# EAGLE design Sonar_Power_Schematic (EAGLE 8.4.0)
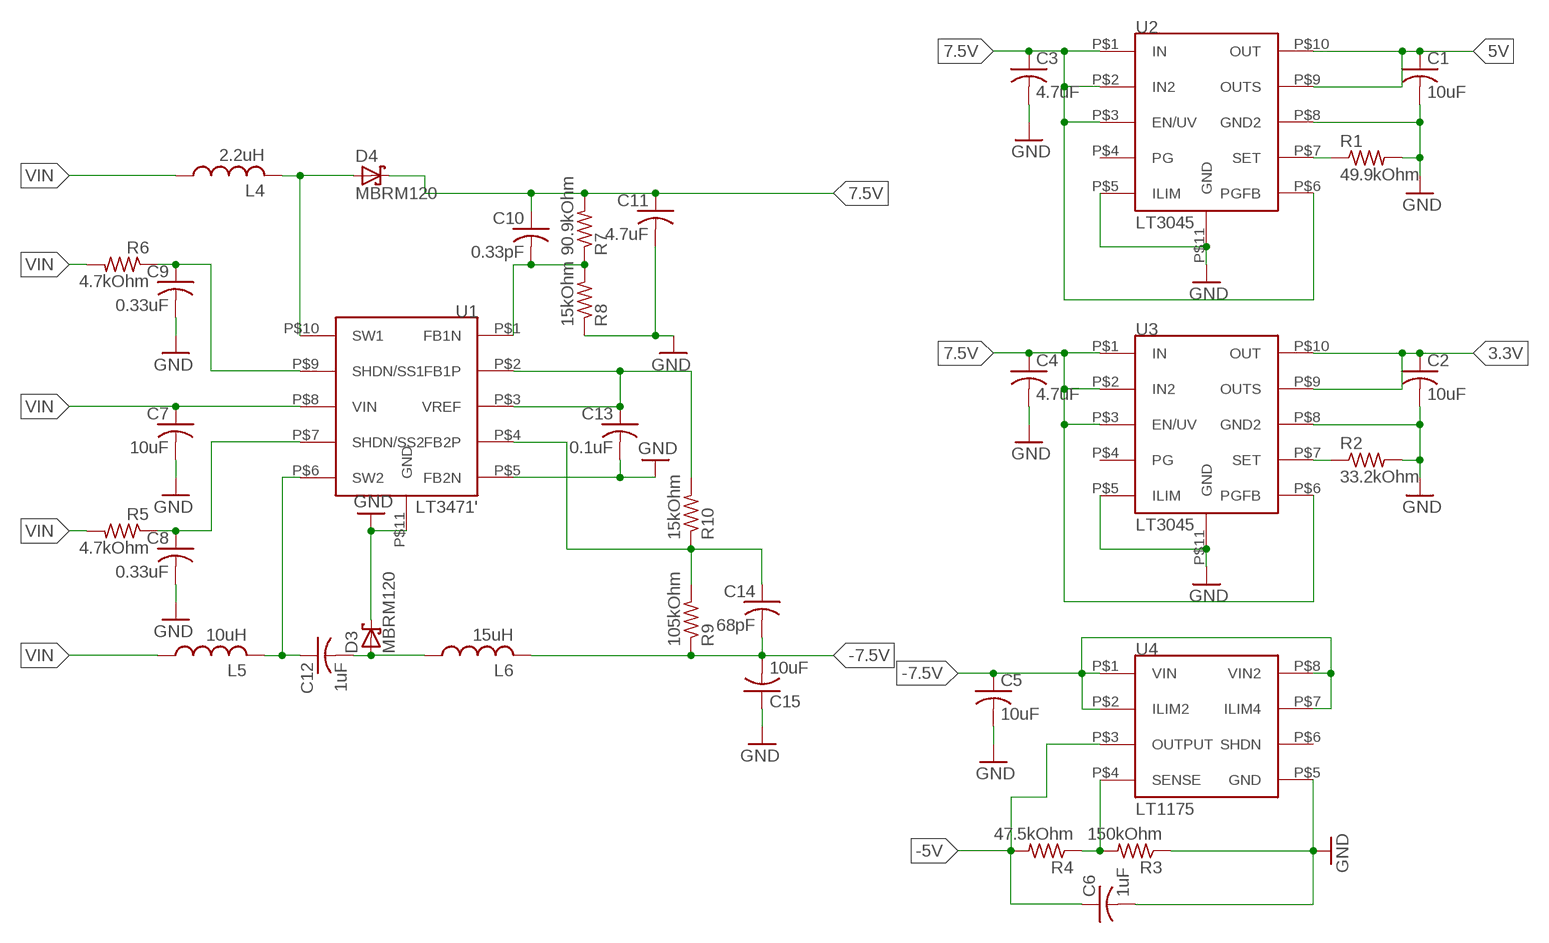
[diagram p0: schematic, sheet 1]

## Parts
C1  10uF  C-USC1206K  [C1206K]
C2  10uF  C-USC1206K  [C1206K]
C3  4.7uF  C-USC0603  [C0603]
C4  4.7uF  C-USC0603  [C0603]
C5  10uF  C-USC0603  [C0603]
C6  1uF  C-USC0603  [C0603]
C7  10uF  C-USC0603  [C0603]
C8  0.33uF  C-USC0603  [C0603]
C9  0.33uF  C-USC0603  [C0603]
C10  0.33pF  C-USC0603  [C0603]
C11  4.7uF  C-USC0603  [C0603]
C12  1uF  C-USC0603  [C0603]
C13  0.1uF  C-USC0603  [C0603]
C14  68pF  C-USC0603  [C0603]
C15  10uF  C-USC0603  [C0603]
D3  MBRM120  [DO-216AA]
D4  MBRM120  [DO-216AA]
L4  2.2uH  LQH5BPN2R2N38L  [NS4.9X4.9]
L5  10uH  VLS5045EX-100M2  [NS5X5]
L6  15uH  VLS5045EX-150M-CA1  [NS5X5]
R1  49.9kOhm  R-US_R0603  [R0603]
R2  33.2kOhm  R-US_R0603  [R0603]
R3  150kOhm  R-US_R0603  [R0603]
R4  47.5kOhm  R-US_R0603  [R0603]
R5  4.7kOhm  R-US_R0603  [R0603]
R6  4.7kOhm  R-US_R0603  [R0603]
R7  90.9kOhm  R-US_R0603  [R0603]
R8  15kOhm  R-US_R0603  [R0603]
R9  105kOhm  R-US_R0603  [R0603]
R10  15kOhm  R-US_R0603  [R0603]
U1  LT3471'  [10-WFDFN]
U2  LT3045  [10-WFDFN]
U3  LT3045  [10-WFDFN]
U4  LT1175  [8-SOIC]

## Nets
3.3V: C2.1 U3.P$9(OUTS) U3.P$10(OUT)
5V: C1.1 U2.P$9(OUTS) U2.P$10(OUT)
7.5V: C3.1 C4.1 C10.1 C11.1 D4.P$1(C) R7.2 U2.P$1(IN) U2.P$2(IN2) U2.P$3(EN/UV) U2.P$6(PGFB) U3.P$1(IN) U3.P$2(IN2) U3.P$3(EN/UV) U3.P$6(PGFB)
-5V: C6.1 R4.2 U4.P$3(OUTPUT)
-7.5V: C5.1 C14.2 C15.2 L6.P$2 R9.1 U4.P$1(VIN) U4.P$2(ILIM2) U4.P$7(ILIM4) U4.P$8(VIN2)
GND: C1.2 C2.2 C3.2 C4.2 C5.2 C6.2 C7.2 C8.2 C9.2 C11.2 C13.2 C15.1 D3.P$1(C) R1.2 R2.2 R3.1 R8.1 U1.P$5(FB2N) U1.P$11(GND) U2.P$5(ILIM) U2.P$8(GND2) U2.P$11(GND) U3.P$5(ILIM) U3.P$8(GND2) U3.P$11(GND) U4.P$5(GND)
N$4: R2.1 U3.P$7(SET)
N$6: R1.1 U2.P$7(SET)
N$9: R3.2 R4.1 U4.P$4(SENSE)
N$17: D4.P$2(A) L4.P$2 U1.P$10(SW1)
N$18: C10.2 R7.1 R8.2 U1.P$1(FB1N)
N$20: C12.1 L5.P$2 U1.P$6(SW2)
N$21: C12.2 D3.P$2(A) L6.P$1
N$26: C14.1 R9.2 R10.1 U1.P$4(FB2P)
SS1: C9.1 R6.1 U1.P$9(SHDN/SS1)
SS2: C8.1 R5.1 U1.P$7(SHDN/SS2)
VIN: C7.1 L4.P$1 L5.P$1 R5.2 R6.2 U1.P$8(VIN)
VREF: C13.1 R10.2 U1.P$2(FB1P) U1.P$3(VREF)
Unconnected: U2.P$4(PG) U3.P$4(PG) U4.P$6(SHDN)

## Library data of the parts
C1-C15 = adafruit:C-US: CAPACITOR, American symbol
D3 D4 = Moira:MBRM120
L4 = Moira:LQH5BPN2R2N38L: 2.2uH
L5 = Moira:VLS5045EX-100M: VLS5045EX-100M, TDK 10uH, 445-174843-1-ND
L6 = Moira:VLS5045EX-150M-CA: VLS5045EX-150M-CA, TDK 15uH, 445-175141-1-ND
R1-R10 = adafruit:R-US_: RESISTOR, American symbol
U1 = Moira:LT3471: LT3471EDD#TRPBF
U2 U3 = Moira:LT3045
U4 = Moira:LT1175: LT1175IS8#PBF

## Board
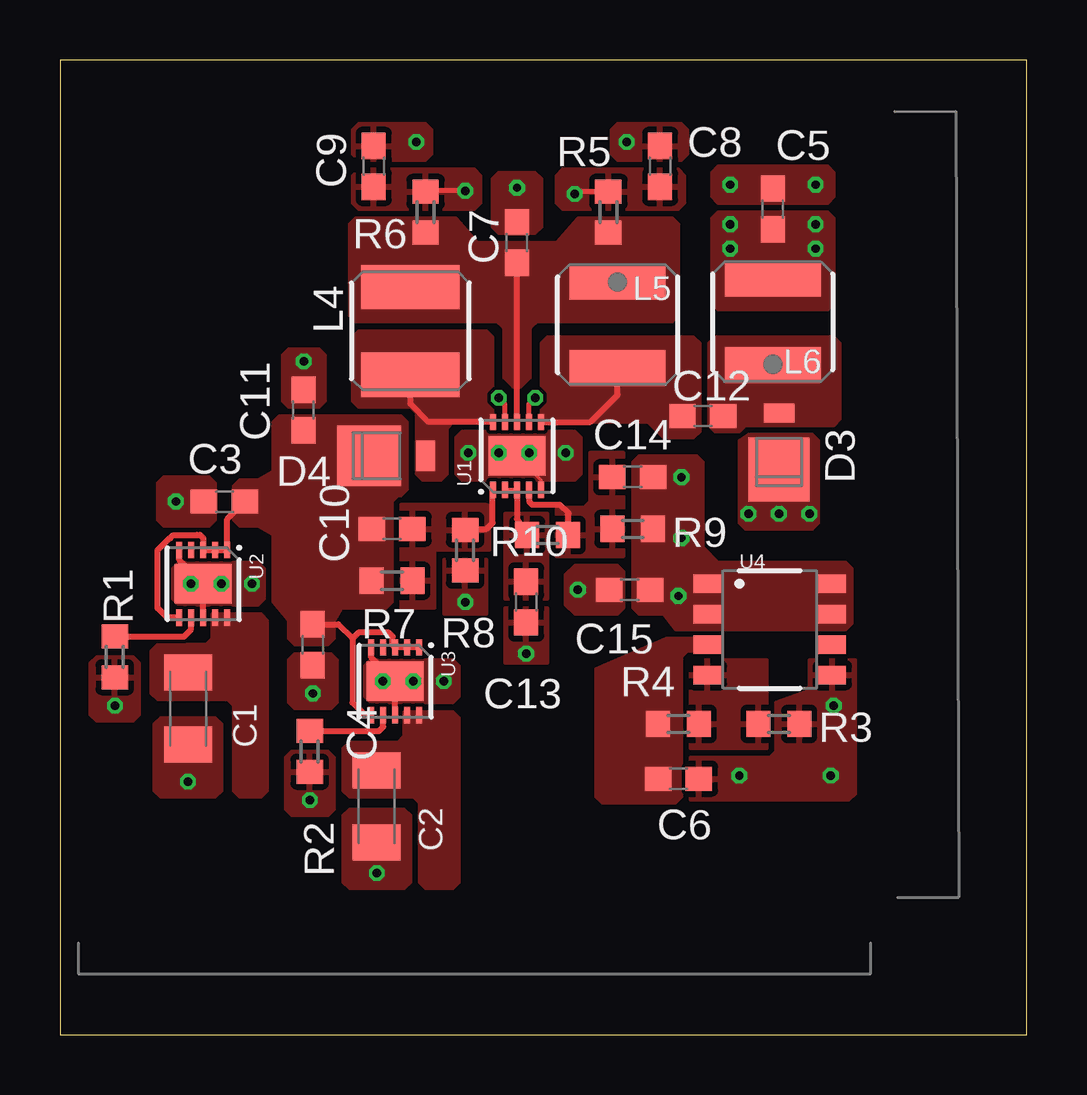
[diagram p1: board, top side]
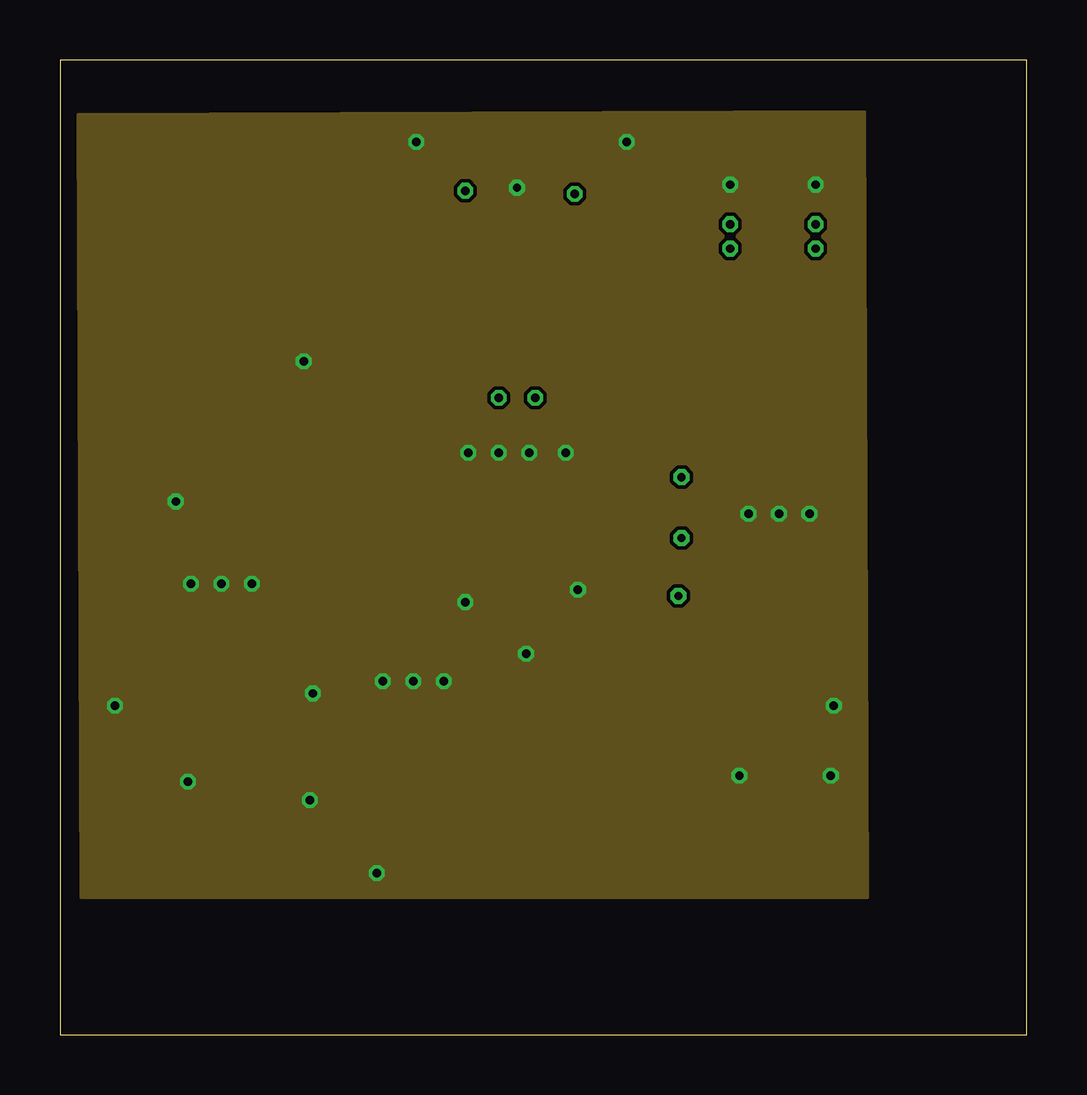
[diagram p2: board, inner layer Route2]
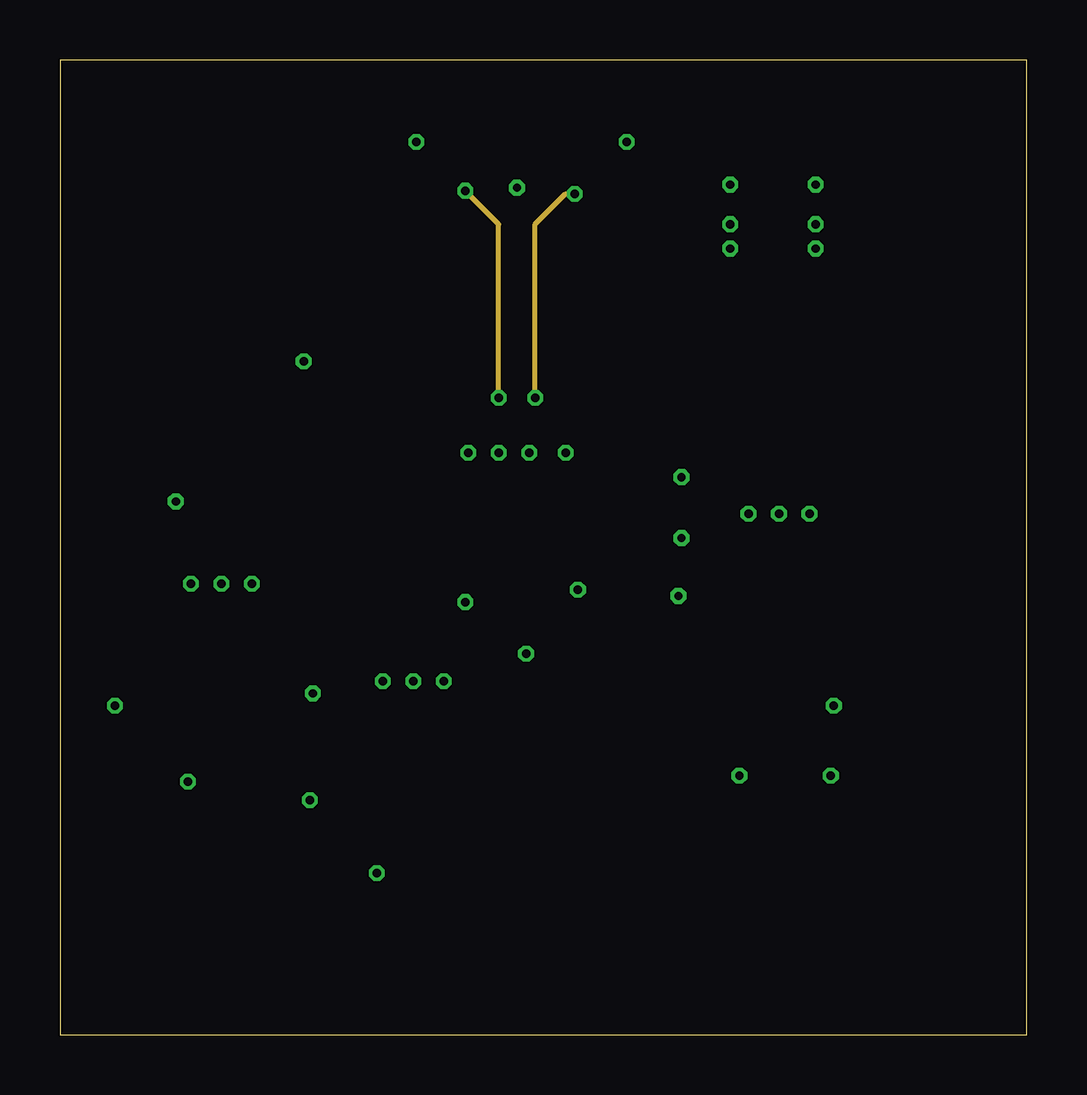
[diagram p3: board, inner layer Route15]
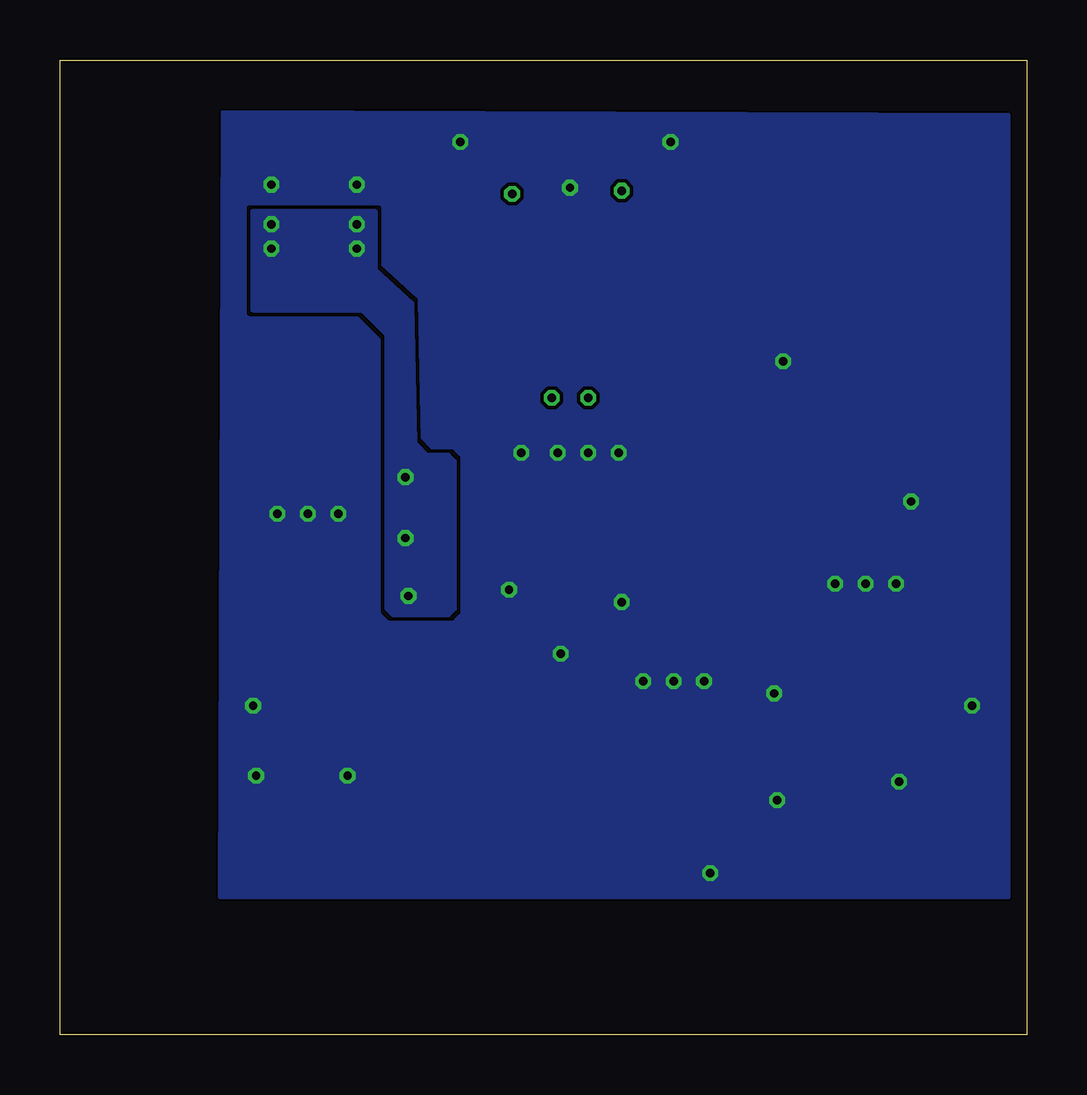
[diagram p4: board, bottom side, seen from below]

Size 40.31 x 40.63 mm. Coordinates in mm from the lower left corner, seen from the top.
Outline: 0,0 40.31,0 40.31,40.63 0,40.63 0,0
Copper layers (1*2*15*16): Top 0.035mm / dielectric 0.1702mm / Route2 0.0175mm / dielectric 47mil / Route15 0.0175mm / dielectric 0.1702mm / Bottom 0.035mm
Design rules "JLCPCB4Layer": minimum track width 6mil, minimum drill 10mil, track to track 6mil, track to pad 6mil, pad to pad 6mil, via to via 6mil, smd to smd 0mil, copper to edge 10mil, drill to drill 10mil, minimum pad ring 6mil, minimum via ring 6mil, stop-mask expansion 2mil, vias tented up to drill 100mil, thermal gap 10mil

### Footprints (pad centres in the part's own frame; a part is rotated, then mirrored left to right if it is on the bottom)
C1206K = smd 1.5 x 2: 1 -1.5,0; 2 1.5,0
C0603 = smd 1.1 x 1: 1 -0.85,0; 2 0.85,0
DO-216AA = smd 2.67 x 2.54: P$1 -0.699,0 | smd 0.8 x 1.27: P$2 1.653,0
NS4.9X4.9 = smd 1.85 x 4.1: P$1 -1.825,0; P$2 1.825,0
NS5X5 = smd 1.5 x 4: P$1 -1.8,0; P$2 1.8,0
R0603 = smd 1 x 1.1: 1 -0.85,0; 2 0.85,0
10-WFDFN = smd 0.675 x 0.25: P$1 -1.413,1; P$2 -1.413,0.5; P$3 -1.413,0; P$4 -1.413,-0.5; P$5 -1.413,-1; P$6 1.413,-1; P$7 1.413,-0.5; P$8 1.413,0; P$9 1.413,0.5; P$10 1.413,1 | smd 1.65 x 2.38: P$11 0,0
8-SOIC = smd 1.143 x 0.762: P$1 -2.603,1.905; P$2 -2.603,0.635; P$3 -2.603,-0.635; P$4 -2.603,-1.905; P$5 2.603,-1.905; P$6 2.603,-0.635; P$7 2.603,0.635; P$8 2.603,1.905

### Placement (x,y rotation side)
C1  5.33,13.59 270 top
C2  13.21,9.52 270 top
C3  6.86,22.22 180 top
C4  10.54,16.26 270 top
C5  29.72,34.42 90 top
C6  25.78,10.67 0 top
C7  19.05,33.02 90 top
C8  25.02,36.2 90 top
C9  13.08,36.2 90 top
C10  13.84,21.08 0 top
C11  10.16,26.04 90 top
C12  26.8,25.78 0 top
C13  19.43,18.03 270 top
C14  23.88,23.24 0 top
C15  23.75,18.54 0 top
D3  29.97,24.26 90 top
D4  13.59,24.13 0 top
L4  14.61,29.34 270 top
L5  23.24,29.59 270 top
L6  29.72,29.72 90 top
R1  2.29,15.75 270 top
R2  10.41,11.81 270 top
R3  29.97,12.95 180 top
R4  25.78,12.95 180 top
R5  22.86,34.29 270 top
R6  15.24,34.29 270 top
R7  13.84,18.92 180 top
R8  16.89,20.19 90 top
R9  23.88,21.08 180 top
R10  20.32,20.83 180 top
U1  19.05,24.13 90 top
U2  5.97,18.8 270 top
U3  13.97,14.73 270 top
U4  29.59,16.89 0 top

### Tracks (layer width: path | path; a pad name or v marks a point on that pad's centre or on a via)
3.3V
  pour Top (no thermals): 16.64,13.21 16.38,13.46 14.35,13.46 14.35,12.45 14.1,12.19 12.07,12.19 11.81,11.94 11.81,10.16 12.07,9.91 14.73,9.91 14.99,9.65 14.99,6.35 15.24,6.1 16.38,6.1 16.64,6.35
5V
  pour Top (no thermals): 8.64,17.27 8.38,17.53 6.35,17.53 6.35,16.51 6.1,16.26 4.06,16.26 3.81,16 3.81,14.22 4.06,13.97 6.99,13.97 7.24,13.72 7.24,10.16 7.49,9.91 8.38,9.91 8.64,10.16
7.5V
  Top 0.254: 12.19,16.51 12.45,16.76 13.71,16.76 13.87,16.6 13.87,16.24 U3.P$3 U3.P$2 U3.P$1 | 12.19,16.51 12.19,13.84 12.71,13.32 U3.P$6 | U2.P$6 4.46,17.38 4.06,17.78 4.06,20.19 4.57,20.7 4.6,20.7 4.73,20.82 5.71,20.82 5.71,20.83 5.84,20.83 5.97,20.7 U2.P$3 U2.P$2 U2.P$1 6.97,21.49 C3.1 | C4.1 11.6,17.11 12.19,16.51
  pour Top (no thermals): 7.24,22.86 7.24,21.46 7.49,21.21 8.26,21.21 9.14,20.7 9.14,23.62 8.26,23.11 7.49,23.11
  pour Top (no thermals): 14.22,25.78 9.14,25.78 8.89,25.53 8.89,18.03 9.14,17.78 13.59,17.78 13.84,18.03 13.84,22.22 14.1,22.48 14.22,22.48 14.48,22.73 14.48,25.53
  pour Top (no thermals): 9.53,16.51 9.78,16.26 11.18,16.26 11.43,16.51 11.43,17.27 11.94,18.16 8.89,18.03 9.53,17.27
-5V
  pour Top (no thermals): 27.56,16.51 25.27,16.51 22.35,15.24 22.35,9.91 22.61,9.65 25.65,9.65 25.91,9.91 25.91,15.75 26.16,16 27.56,16
-7.5V  (via drill 0.35)
  other vias: 25.91,23.24 27.94,33.78 31.5,33.78 25.78,18.29 25.91,20.7 27.94,32.77 31.5,32.77
  pour Top (no thermals): 25.78,19.68 25.78,16.89 32.77,16.89 33.02,17.14 33.02,19.43 32.77,19.68
  pour Top (no thermals): 27.18,34.04 27.18,30.48 27.43,30.23 32,30.23 32.26,30.48 32.26,34.04 32,34.29 27.43,34.29
  pour Top (no thermals): 23.88,23.88 23.88,17.78 24.13,17.53 25.15,17.53 25.65,16.89 27.43,16.89 27.43,19.68 26.8,20.32 26.8,23.88 26.54,24.13 24.13,24.13
  pour Bottom (no thermals): 27.18,31.88 27.18,34.29 32.26,34.29 32.26,30.23 27.69,30.23 26.67,29.21 26.67,17.78 26.42,17.53 24.13,17.53 23.88,17.78 23.88,23.88 24.13,24.13 25.02,24.13 25.53,24.64 25.65,30.48
GND  (via drill 0.35)
  Top 0.152: U1.P$5 20.05,23.13 U1.P$11
  Top 0.254: U3.P$8 U3.P$11 12.97,15.73 U3.P$5 | U2.P$8 U2.P$11 4.97,19.8 U2.P$5
  other vias: 5.33,10.54 4.83,22.22 10.54,14.22 21.59,18.54 19.05,35.31 13.21,6.73 10.41,9.78 17.02,24.26 21.08,24.26 16.89,18.03 14.86,37.21 16,14.73 8,18.8 19.43,15.88 2.29,13.72 23.62,37.21 27.94,35.43 31.5,35.43 10.16,28.07 29.97,21.72 18.29,24.26 19.56,24.26 6.73,18.8 5.46,18.8 14.73,14.73 13.46,14.73 28.7,21.72 31.24,21.72 32.26,13.72 28.32,10.79 32.13,10.79
  pour Top (no thermals): 18.29,35.94 18.03,35.69 18.03,33.66 18.29,33.4 19.81,33.4 20.07,33.66 20.07,35.69 19.81,35.94
  pour Top (no thermals): 4.06,22.99 4.06,21.46 4.32,21.21 6.22,21.21 6.48,21.46 6.48,22.99 6.22,23.24 4.32,23.24
  pour Top (no thermals): 11.3,15.88 9.78,15.88 9.53,15.62 9.53,13.84 9.78,13.59 11.3,13.59 11.56,13.84 11.56,15.62
  pour Top (no thermals): 23.5,17.78 23.5,19.3 23.24,19.56 21.46,19.56 21.08,19.18 21.08,17.91 21.46,17.53 23.24,17.53
  pour Top (no thermals): 3.94,12.95 3.94,10.16 4.19,9.91 6.48,9.91 6.73,10.16 6.73,12.95 6.48,13.21 4.19,13.21
  pour Route2: 0.76,38.35 33.53,38.48 33.66,5.71 0.89,5.71
  pour Top (no thermals): 14.61,9.14 14.61,6.35 14.35,6.1 12.07,6.1 11.81,6.35 11.81,9.14 12.07,9.4 14.35,9.4
  pour Top: 11.43,11.56 11.18,11.81 9.65,11.81 9.4,11.56 9.4,9.4 9.65,9.14 11.18,9.14 11.43,9.4
  pour Top (no thermals): 16.51,24.89 16.51,23.37 16.76,23.11 21.46,23.11 21.72,23.37 21.72,24.89 21.46,25.15 16.76,25.15
  pour Top: 16,19.81 17.78,19.81 17.78,17.53 16,17.53
  pour Top: 12.19,37.72 12.19,36.7 12.45,36.45 15.24,36.45 15.49,36.7 15.49,37.72 15.24,37.97 12.45,37.97
  pour Top (no thermals): 16.38,15.62 12.95,15.62 12.7,15.37 12.7,14.1 12.95,13.84 16.38,13.84 16.64,14.1 16.64,15.37
  pour Top (no thermals): 4.7,19.43 4.7,18.16 4.95,17.91 8.26,17.91 8.51,18.16 8.51,19.43 8.26,19.68 4.95,19.68
  pour Top: 18.54,17.78 18.54,15.49 20.32,15.49 20.32,17.78
  pour Bottom (rank 2): 0.76,38.35 0.76,5.71 33.66,5.71 33.53,38.48
  pour Top: 1.27,15.49 1.27,13.33 1.52,13.08 3.05,13.08 3.3,13.33 3.3,15.49 3.05,15.75 1.52,15.75
  pour Top: 23.24,37.97 22.99,37.72 22.99,36.7 23.24,36.45 25.91,36.45 26.16,36.7 26.16,37.72 25.91,37.97
  pour Top (no thermals): 32.26,34.92 32.26,35.94 32,36.2 27.43,36.2 27.18,35.94 27.18,34.92 27.43,34.67 32,34.67
  pour Top (no thermals): 9.53,28.57 10.79,28.57 11.05,28.32 11.05,26.42 10.79,26.16 9.53,26.16 9.27,26.42 9.27,28.32
  pour Top (no thermals): 28.32,24.77 28.7,25.02 31.37,25.02 31.62,24.77 31.62,21.34 31.37,21.08 28.58,21.08 28.32,21.34
  pour Top: 29.59,11.56 29.84,11.81 29.84,13.84 31.24,14.35 31.24,15.62 33.15,15.62 33.15,10.03 32.89,9.78 26.29,9.78 26.29,11.56
N$4
  Top 0.254: R2.1 13.3,12.66 13.47,12.83 U3.P$7
N$6
  Top 0.254: R1.1 5.17,16.6 5.46,16.89 U2.P$7
N$9
  pour Top: 26.29,11.94 29.46,11.94 29.46,15.62 26.29,15.62
N$17
  Top 0.254: U1.P$10 15.35,25.54 14.61,26.29 L4.P$2
  pour Top (no thermals): 18.03,29.08 18.03,25.78 17.78,25.53 16.38,25.53 16.13,25.27 16.13,23.37 15.88,23.11 15.11,23.11 14.86,23.37 14.86,25.91 14.61,26.16 12.45,26.16 12.19,26.42 12.19,29.08 12.45,29.34 17.78,29.34
N$18
  Top 0.254: R8.2 16.93,21.08 17.78,21.08 18.03,21.34 18.03,22.7 U1.P$1
  pour Top: 14.22,22.1 14.22,17.78 15.62,17.78 15.62,20.19 17.91,20.19 17.91,22.1
N$20
  Top 0.254: U1.P$6 22.11,25.54 23.24,26.67 L5.P$2
  pour Top (no thermals): 26.67,28.83 26.67,25.15 26.42,24.89 25.15,24.89 24.51,25.53 20.32,25.53 20.07,25.78 20.07,28.83 20.32,29.08 26.42,29.08
N$21
  pour Top (no thermals): 27.05,28.83 27.05,25.4 27.3,25.15 28.32,25.15 28.58,25.4 32.26,25.4 32.51,25.65 32.51,28.83 32.26,29.08 27.3,29.08
N$26
  Top 0.254: U1.P$4 19.56,22.22 19.69,22.1 20.83,22.1 21.21,21.72 21.17,21.68 R10.1
  pour Top: 20.7,21.97 20.7,19.94 23.5,19.94 23.5,24.26 22.1,24.26 22.1,22.22 21.84,21.97
SS1  (via drill 0.35)
  Top 0.203: U1.P$9 18.55,26.28 v18.29,26.54 | v16.89,35.18 15.28,35.18 R6.1
  Route15 0.203: v18.29,26.54 18.29,33.78 v16.89,35.18
  pour Top: 12.45,36.07 12.19,35.81 12.19,34.67 12.45,34.42 17.27,34.42 17.53,34.67 17.53,35.81 17.27,36.07
SS2  (via drill 0.35)
  Top 0.203: U1.P$7 19.55,26.28 v19.81,26.54 | R5.1 21.55,35.14 v21.46,35.05
  Route15 0.203: v19.81,26.54 19.81,33.78 21.08,35.05 v21.46,35.05
  pour Top: 20.7,35.81 20.7,34.67 20.96,34.42 25.78,34.42 26.04,34.67 26.04,35.81 25.78,36.07 20.96,36.07
VIN
  Top 0.254: U1.P$8 C7.1
  pour Top (no thermals): 12.07,33.78 12.07,29.97 12.32,29.72 25.53,29.72 25.78,30.1 25.78,33.78 25.53,34.04 21.59,34.04 20.7,33.02 17.4,33.02 16.51,34.04 12.32,34.04
  pour Top: 18.54,29.46 18.54,27.43 18.92,27.05 19.18,27.05 19.56,27.43 19.56,29.46 19.94,29.84 19.94,32.77 18.29,32.77 18.16,32.64 18.16,29.84
VREF
  Top 0.152: U1.P$2 U1.P$3
  Top 0.254: U1.P$3 19.05,21.5 R10.2
  pour Top: 18.54,21.72 18.54,18.16 20.32,18.16 20.32,21.72